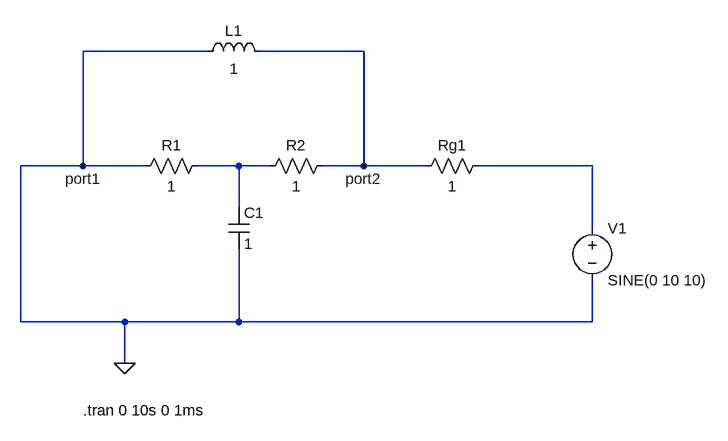
[diagram p0: schematic Part1_2.asc]
Part1_2.asc, the LTspice schematic file:
Version 4
SHEET 1 1256 680
WIRE 464 -96 272 -96
WIRE 704 -96 544 -96
WIRE 272 80 272 -96
WIRE 272 80 176 80
WIRE 368 80 272 80
WIRE 512 80 448 80
WIRE 560 80 512 80
WIRE 704 80 704 -96
WIRE 704 80 640 80
WIRE 800 80 704 80
WIRE 1056 80 880 80
WIRE 512 144 512 80
WIRE 1056 176 1056 80
WIRE 176 320 176 80
WIRE 336 320 176 320
WIRE 512 320 512 208
WIRE 512 320 336 320
WIRE 1056 320 1056 256
WIRE 1056 320 512 320
WIRE 336 384 336 320
FLAG 336 384 0
FLAG 272 80 port1
FLAG 704 80 port2
SYMBOL res 464 64 R90
WINDOW 0 0 56 VBottom 2
WINDOW 3 32 56 VTop 2
SYMATTR InstName R1
SYMATTR Value 1
SYMBOL res 656 64 R90
WINDOW 0 0 56 VBottom 2
WINDOW 3 32 56 VTop 2
SYMATTR InstName R2
SYMATTR Value 1
SYMBOL cap 496 144 R0
SYMATTR InstName C1
SYMATTR Value 1
SYMBOL ind 448 -80 R270
WINDOW 0 32 56 VTop 2
WINDOW 3 5 56 VBottom 2
SYMATTR InstName L1
SYMATTR Value 1
SYMBOL res 896 64 R90
WINDOW 0 0 56 VBottom 2
WINDOW 3 32 56 VTop 2
SYMATTR InstName Rg1
SYMATTR Value 1
SYMBOL voltage 1056 160 R0
WINDOW 123 0 0 Left 2
WINDOW 39 0 0 Left 2
SYMATTR InstName V1
SYMATTR Value SINE(0 10 10)
TEXT 272 456 Left 2 !.tran 0 10s 0 1ms

The netlist it stands for:
* Part1_2.asc
R1 N001 0 1
R2 port2 N001 1
C1 N001 0 1
L1 0 port2 1
Rg1 N002 port2 1
V1 N002 0 SINE(0 10 10)
.tran 0 10s 0 1ms
.backanno
.end